# EAGLE design momoinololu (EAGLE 6.3)
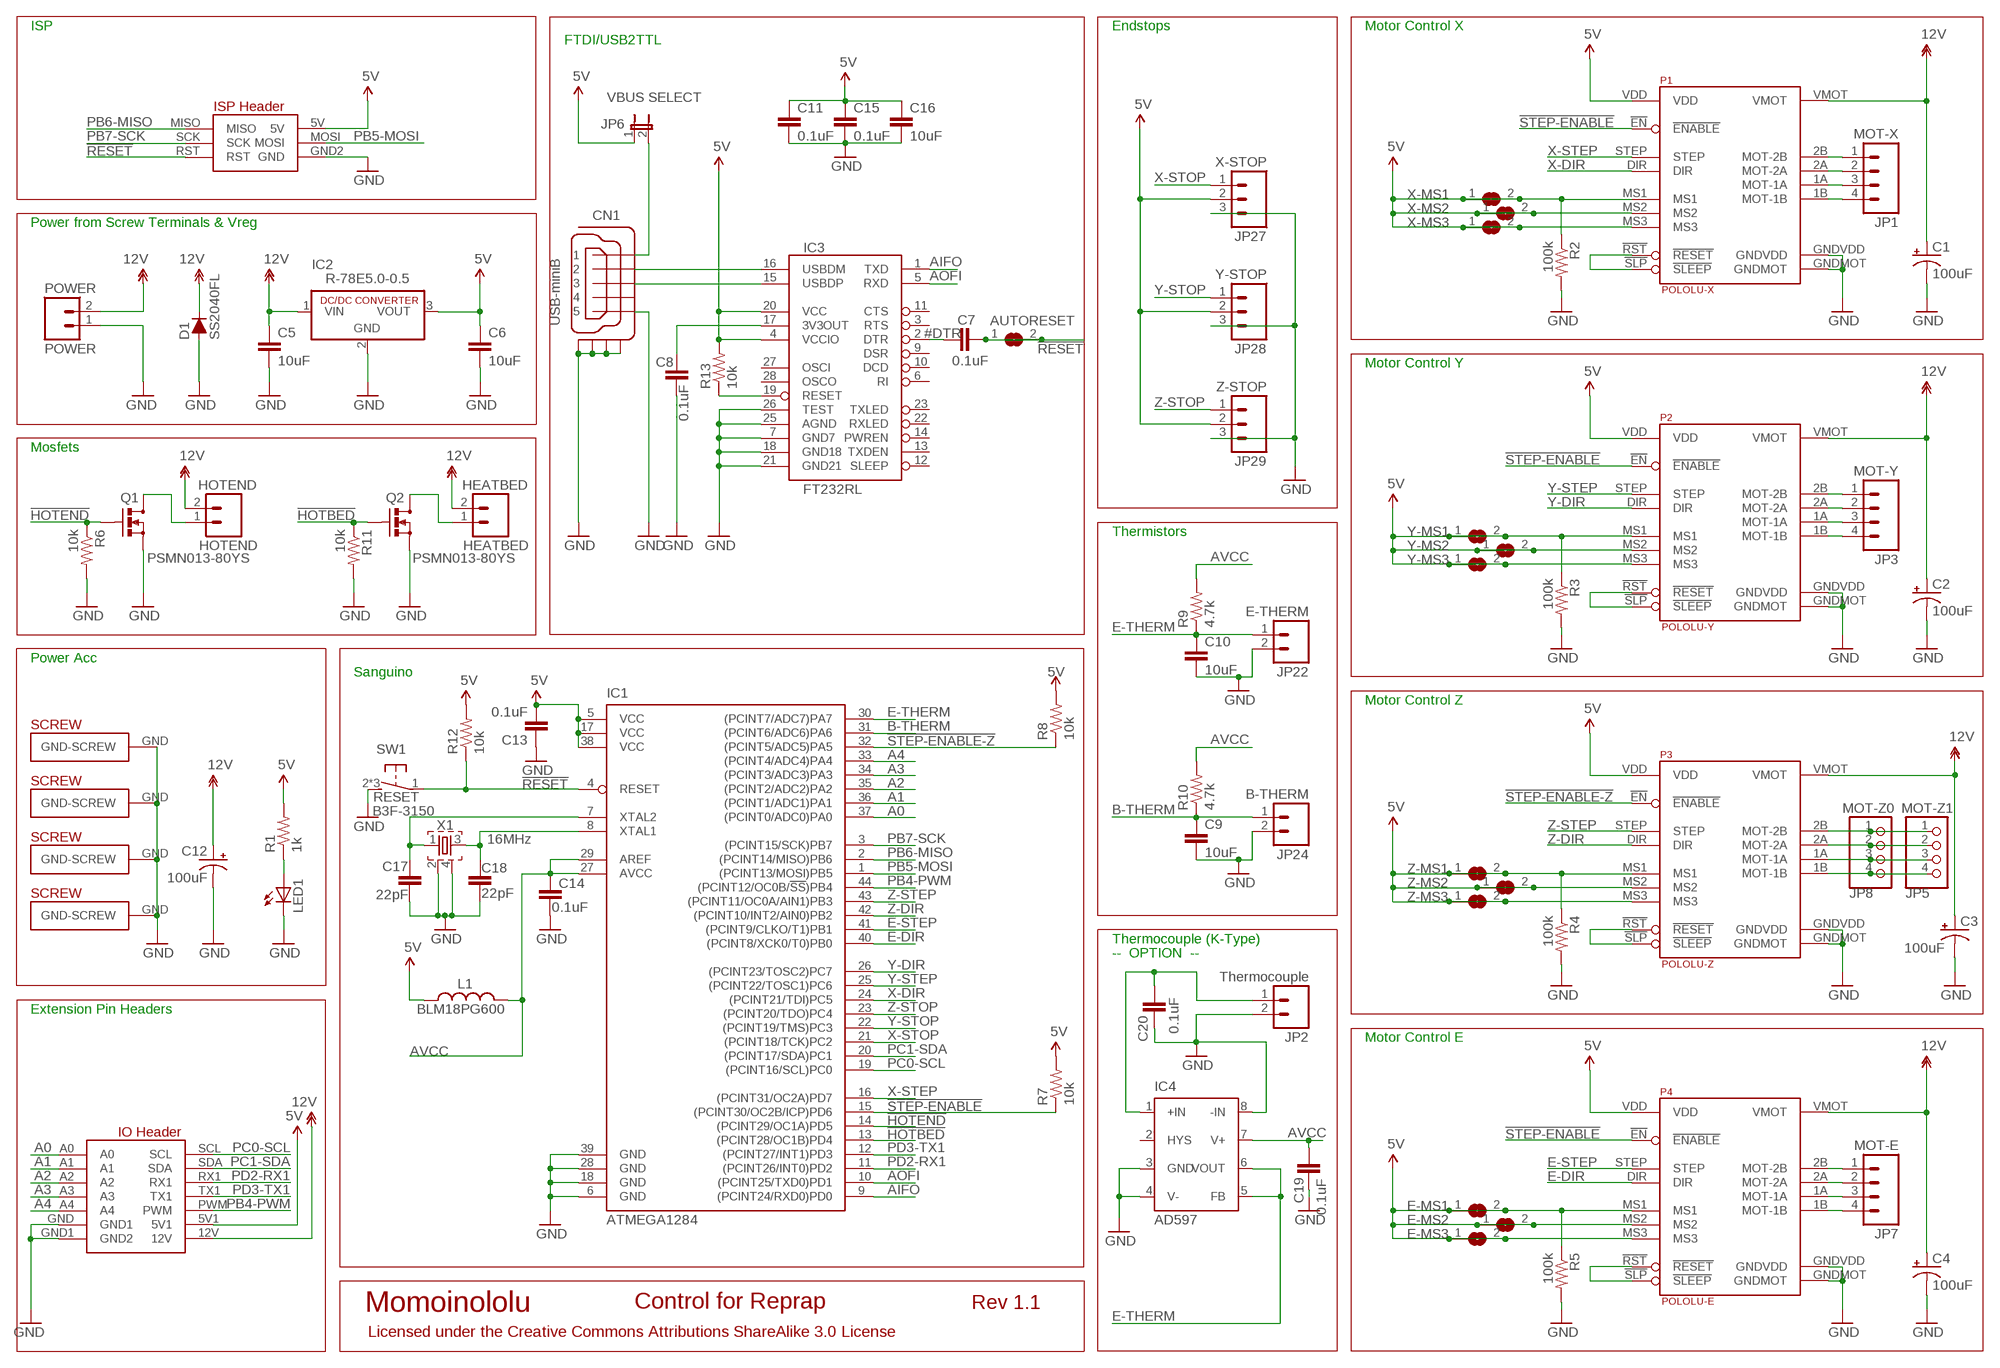
[diagram p0: schematic, sheet 1]

## Parts
AUTORESET  SJ  [SJ]
C1  100uF  CPOL-USUD-6,3X7,7  [UD-6,3X7,7_NICHICON]
C2  100uF  CPOL-USUD-6,3X7,7  [UD-6,3X7,7_NICHICON]
C3  100uF  CPOL-USUD-6,3X7,7  [UD-6,3X7,7_NICHICON]
C4  100uF  CPOL-USUD-6,3X7,7  [UD-6,3X7,7_NICHICON]
C5  10uF  RCL_C-EUC1206K  [RCL_C1206K]
C6  10uF  RCL_C-EUC1206K  [RCL_C1206K]
C7  0.1uF  C-EUC0603  [C0603]
C8  0.1uF  C-EUC0603  [C0603]
C9  10uF  RCL_C-EUC1206K  [RCL_C1206K]
C10  10uF  RCL_C-EUC1206K  [RCL_C1206K]
C11  0.1uF  C-EUC0603  [C0603]
C12  100uF  CPOL-USUD-6,3X7,7  [UD-6,3X7,7_NICHICON]
C13  0.1uF  C-EUC0603  [C0603]
C14  0.1uF  C-EUC0603  [C0603]
C15  0.1uF  C-EUC0603  [C0603]
C16  10uF  RCL_C-EUC1206K  [RCL_C1206K]
C17  22pF  C-EUC0603  [C0603]
C18  22pF  C-EUC0603  [C0603]
C19  0.1uF  C-EUC0603  [C0603]
C20  0.1uF  C-EUC0603  [C0603]
CN1  USB-miniB  CON-HIROSE_MINI-USB-SHIELD-UX60A-MB-5ST  [CON-HIROSE_UX60A-MB-5ST]
D1  SS2040FL  SEMICON-SMD-IPC_D-FILL-SOD123  [SEMICON-SMD-IPC_SOD123]
E-MS1  SJ  [SJ]
E-MS2  SJ  [SJ]
E-MS3  SJ  [SJ]
HEATBED  HEATBED  SPARKFUN_M025.08MM  [SCREWTERMINAL-5.08MM-2]
HOTEND  HOTEND  SPARKFUN_M025.08MM  [SCREWTERMINAL-5.08MM-2]
IC1  ATMEGA1284  ATMEGA644A  [TQFP44]
IC2  R-78E5.0-0.5  R-78C5.0-1.0  [SIP3]
IC3  FT232RL  FT232RLSSOP  [SSOP28DB]
IC4  AD597  [SO8]
JP1  MOT-X  SPARKFUN_M04POLAR  [SPARKFUN_MOLEX-1X4]
JP2  Thermocouple  SPARKFUN_M02PTH  [SPARKFUN_1X02]
JP3  MOT-Y  SPARKFUN_M04POLAR  [SPARKFUN_MOLEX-1X4]
JP5  MOT-Z1  PINHD-1X4  [1X04]
JP6  VBUS SELECT  SPARKFUN_JUMPER-2PTH  [SPARKFUN_1X02]
JP7  MOT-E  SPARKFUN_M04POLAR  [SPARKFUN_MOLEX-1X4]
JP8  MOT-Z0  PINHD-1X4  [1X04]
JP22  E-THERM  SPARKFUN_M02PTH  [SPARKFUN_1X02]
JP24  B-THERM  SPARKFUN_M02PTH  [SPARKFUN_1X02]
JP27  X-STOP  SPARKFUN_M03POLAR  [SPARKFUN_MOLEX-1X3]
JP28  Y-STOP  SPARKFUN_M03POLAR  [SPARKFUN_MOLEX-1X3]
JP29  Z-STOP  SPARKFUN_M03POLAR  [SPARKFUN_MOLEX-1X3]
L1  BLM18PG600  L-USL0603  [L0603]
LED1  LEDSML0805  [SML0805]
P1  POLOLU-X  POLOLU-ALLEGRO_POLOLU-ALLEGRO  [POLOLU-ALLEGRO_POLOLU-ALLEGRO-PTH]
P2  POLOLU-Y  POLOLU-ALLEGRO_POLOLU-ALLEGRO  [POLOLU-ALLEGRO_POLOLU-ALLEGRO-PTH]
P3  POLOLU-Z  POLOLU-ALLEGRO_POLOLU-ALLEGRO  [POLOLU-ALLEGRO_POLOLU-ALLEGRO-PTH]
P4  POLOLU-E  POLOLU-ALLEGRO_POLOLU-ALLEGRO  [POLOLU-ALLEGRO_POLOLU-ALLEGRO-PTH]
POWER  POWER  SPARKFUN_M025.08MM  [SCREWTERMINAL-5.08MM-2]
Q1  PSMN013-80YS  SPARKFUN_MOSFET-NCHANNELSOT669  [SOT669]
Q2  PSMN013-80YS  SPARKFUN_MOSFET-NCHANNELSOT669  [SOT669]
R1  1k  R-US_R0603  [R0603]
R2  100k  R-US_R0603  [R0603]
R3  100k  R-US_R0603  [R0603]
R4  100k  R-US_R0603  [R0603]
R5  100k  R-US_R0603  [R0603]
R6  10k  R-US_R0603  [R0603]
R7  10k  R-US_R0603  [R0603]
R8  10k  R-US_R0603  [R0603]
R9  4.7k  R-US_R0603  [R0603]
R10  4.7k  R-US_R0603  [R0603]
R11  10k  R-US_R0603  [R0603]
R12  10k  R-US_R0603  [R0603]
R13  10k  R-US_R0603  [R0603]
SW1  B3F-3150  31-XX  [B3F-31XX]
U$17  PLATED-SCREW  [PLATEDSCREW]
U$20  PLATED-SCREW  [PLATEDSCREW]
U$24  SANGUINOLOLU_IO_HEADERSNOSCREW  [SANGUINOLOLU_IO_HEADER_NOSCREW]
U$25  PLATED-SCREW  [PLATEDSCREW]
U$31  PLATED-SCREW  [PLATEDSCREW]
X1  16MHz  FA-238  [FA-238]
X-MS1  SJ  [SJ]
X-MS2  SJ  [SJ]
X-MS3  SJ  [SJ]
Y-MS1  SJ  [SJ]
Y-MS2  SJ  [SJ]
Y-MS3  SJ  [SJ]
Z-MS1  SJ  [SJ]
Z-MS2  SJ  [SJ]
Z-MS3  SJ  [SJ]

## Nets
3V3: C8.1 IC3.17(3V3OUT)
5V: C6.1 C11.1 C13.2 C15.1 C16.1 E-MS1.1 E-MS1.2 E-MS2.1 E-MS2.2 E-MS3.1 E-MS3.2 IC1.5(VCC) IC1.17(VCC) IC1.38(VCC) IC2.3(VOUT) IC3.4(VCCIO) IC3.20(VCC) JP6.1 JP27.2 JP28.2 JP29.2 L1.1 P1.MS1 P1.MS2 P1.MS3 P1.VDD P2.MS1 P2.MS2 P2.MS3 P2.VDD P3.MS1 P3.MS2 P3.MS3 P3.VDD P4.MS1 P4.MS2 P4.MS3 P4.VDD R1.2 R2.1 R3.1 R4.1 R5.1 R7.2 R8.2 R12.2 R13.2 U$24.5V U$24.5V1 X-MS1.1 X-MS1.2 X-MS2.1 X-MS2.2 X-MS3.1 X-MS3.2 Y-MS1.1 Y-MS1.2 Y-MS2.1 Y-MS2.2 Y-MS3.1 Y-MS3.2 Z-MS1.1 Z-MS1.2 Z-MS2.1 Z-MS2.2 Z-MS3.1 Z-MS3.2
12V: C1.+ C2.+ C3.+ C4.+ C5.1 C12.+ D1.1(C) HEATBED.2 HOTEND.2 IC2.1(VIN) P1.VMOT P2.VMOT P3.VMOT P4.VMOT POWER.2 U$24.12V
!HOTBED: IC1.13((PCINT28/OC1B)PD4) Q2.4(G) R11.1
!HOTEND: IC1.14((PCINT29/OC1A)PD5) Q1.4(G) R6.1
!RESET: AUTORESET.1 AUTORESET.2 C7.1 IC1.4(RESET) R12.1 SW1.1(P) U$24.RST
!STEP-ENABLE: IC1.15((PCINT30/OC2B/ICP)PD6) P1.!EN(!ENABLE) P2.!EN(!ENABLE) P4.!EN(!ENABLE) R7.1
!STEP-ENABLE-Z: IC1.32((PCINT5/ADC5)PA5) P3.!EN(!ENABLE) R8.1
#DTR: C7.2 IC3.2(DTR)
+IN: C20.1 IC4.1(+IN) JP2.1
A0: IC1.37((PCINT0/ADC0)PA0) U$24.A0
A1: IC1.36((PCINT1/ADC1)PA1) U$24.A1
A2: IC1.35((PCINT2/ADC2)PA2) U$24.A2
A3: IC1.34((PCINT3/ADC3)PA3) U$24.A3
A4: IC1.33((PCINT4/ADC4)PA4) U$24.A4
AIFO: IC1.9((PCINT24/RXD0)PD0) IC3.1(TXD)
AOFI: IC1.10((PCINT25/TXD0)PD1) IC3.5(RXD)
AVCC: C14.1 C19.1 IC1.27(AVCC) IC1.29(AREF) IC4.7(V+) L1.2 R9.2 R10.2
B-THERM: C9.1 IC1.31((PCINT6/ADC6)PA6) JP24.1 R10.1
E-DIR: IC1.40((PCINT8/XCK0/T0)PB0) P4.DIR
E-MOT-1A [power]: JP7.3 P4.1A(MOT-1A)
E-MOT-1B [power]: JP7.4 P4.1B(MOT-1B)
E-MOT-2A [power]: JP7.2 P4.2A(MOT-2A)
E-MOT-2B [power]: JP7.1 P4.2B(MOT-2B)
E-RESETSLEEP: P4.!RST(!RESET) P4.!SLP(!SLEEP)
E-STEP: IC1.41((PCINT9/CLKO/T1)PB1) P4.STEP
E-THERM: C10.1 IC1.30((PCINT7/ADC7)PA7) IC4.5(FB) IC4.6(VOUT) JP22.1 R9.1
GND: C1.- C2.- C3.- C4.- C5.2 C6.2 C8.2 C9.2 C10.2 C11.2 C12.- C13.1 C14.2 C15.2 C16.2 C17.2 C18.2 C19.2 C20.2 CN1.5 CN1.M1(S1) CN1.M2(S2) CN1.M3(S3) CN1.M4(S4) D1.2(A) IC1.6(GND) IC1.18(GND) IC1.28(GND) IC1.39(GND) IC2.2(GND) IC3.7(GND7) IC3.18(GND18) IC3.21(GND21) IC3.25(AGND) IC3.26(TEST) IC4.3(GND) IC4.4(V-) IC4.8(-IN) JP2.2 JP22.2 JP24.2 JP27.3 JP28.3 JP29.3 LED1.C P1.GNDMOT P1.GNDVDD P2.GNDMOT P2.GNDVDD P3.GNDMOT P3.GNDVDD P4.GNDMOT P4.GNDVDD POWER.1 Q1.1(S) Q1.2(S) Q1.3(S) Q2.1(S) Q2.2(S) Q2.3(S) R2.2 R3.2 R4.2 R5.2 R6.2 R11.2 SW1.2(S) SW1.3(S) SW1.4(S) U$17.GND(GND-SCREW) U$20.GND(GND-SCREW) U$24.GND1(GND2) U$24.GND2(GND) U$24.GND(GND1) U$25.GND(GND-SCREW) U$31.GND(GND-SCREW) X1.2 X1.4
HEATBED-GND [power]: HEATBED.1 Q2.MB(D)
HOTEND-GND: HOTEND.1 Q1.MB(D)
LED1: LED1.A R1.1
N$1: C17.1 IC1.7(XTAL2) X1.1
N$2: IC3.19(RESET) R13.1
N$3: C18.1 IC1.8(XTAL1) X1.3
N$6: CN1.2 IC3.16(USBDM)
N$7: CN1.3 IC3.15(USBDP)
PB4-PWM: IC1.44((PCINT12/OC0B/!SS!)PB4) U$24.PWM
PB5-MOSI: IC1.1((PCINT13/MOSI)PB5) U$24.MOSI
PB6-MISO: IC1.2((PCINT14/MISO)PB6) U$24.MISO
PB7-SCK: IC1.3((PCINT15/SCK)PB7) U$24.SCK
PC0-SCL: IC1.19((PCINT16/SCL)PC0) U$24.SCL
PC1-SDA: IC1.20((PCINT17/SDA)PC1) U$24.SDA
PD2-RX1: IC1.11((PCINT26/INT0)PD2) U$24.RX1
PD3-TX1: IC1.12((PCINT27/INT1)PD3) U$24.TX1
VBUS: CN1.1 JP6.2
X-DIR: IC1.24((PCINT21/TDI)PC5) P1.DIR
X-MOT-1A [power]: JP1.3 P1.1A(MOT-1A)
X-MOT-1B [power]: JP1.4 P1.1B(MOT-1B)
X-MOT-2A [power]: JP1.2 P1.2A(MOT-2A)
X-MOT-2B [power]: JP1.1 P1.2B(MOT-2B)
X-RESETSLEEP: P1.!RST(!RESET) P1.!SLP(!SLEEP)
X-STEP: IC1.16((PCINT31/OC2A)PD7) P1.STEP
X-STOP: IC1.21((PCINT18/TCK)PC2) JP27.1
Y-DIR: IC1.26((PCINT23/TOSC2)PC7) P2.DIR
Y-MOT-1A [power]: JP3.3 P2.1A(MOT-1A)
Y-MOT-1B [power]: JP3.4 P2.1B(MOT-1B)
Y-MOT-2A [power]: JP3.2 P2.2A(MOT-2A)
Y-MOT-2B [power]: JP3.1 P2.2B(MOT-2B)
Y-RESETSLEEP: P2.!RST(!RESET) P2.!SLP(!SLEEP)
Y-STEP: IC1.25((PCINT22/TOSC1)PC6) P2.STEP
Y-STOP: IC1.22((PCINT19/TMS)PC3) JP28.1
Z-DIR: IC1.42((PCINT10/INT2/AIN0)PB2) P3.DIR
Z-MOT-1A [power]: JP5.3 JP8.3 P3.1A(MOT-1A)
Z-MOT-1B [power]: JP5.4 JP8.4 P3.1B(MOT-1B)
Z-MOT-2A [power]: JP5.2 JP8.2 P3.2A(MOT-2A)
Z-MOT-2B [power]: JP5.1 JP8.1 P3.2B(MOT-2B)
Z-RESETSLEEP: P3.!RST(!RESET) P3.!SLP(!SLEEP)
Z-STEP: IC1.43((PCINT11/OC0A/AIN1)PB3) P3.STEP
Z-STOP: IC1.23((PCINT20/TDO)PC4) JP29.1
Unconnected: CN1.4 IC3.3(RTS) IC3.6(RI) IC3.9(DSR) IC3.10(DCD) IC3.11(CTS) IC3.12(SLEEP) IC3.13(TXDEN) IC3.14(PWREN) IC3.22(RXLED) IC3.23(TXLED) IC3.27(OSCI) IC3.28(OSCO) IC4.2(HYS)

## Notes on the sheet
- ISP | Endstops | Motor Control X
- FTDI/USB2TTL
- Power from Screw Terminals & Vreg
- Motor Control Y
- Mosfets
- Thermistors
- Power Acc
- Sanguino
- Motor Control Z
- RESET
- Thermocouple (K-Type)
- --  OPTION  --
- Extension Pin Headers
- Motor Control E
- Momoinololu | Control for Reprap | Rev 1.1
- Licensed under the Creative Commons Attributions ShareAlike 3.0 License

## Library data of the parts
AUTORESET E-MS1-E-MS3 X-MS1-X-MS3 Y-MS1-Y-MS3 Z-MS1-Z-MS3 = Sanguinololu:SJ: SMD solder JUMPER
C1-C4 C12 = rcl:CPOL-US: POLARIZED CAPACITOR, American symbol
C5 C6 C9 C10 C16 = Sanguinololu:RCL_C-EU: CAPACITOR, European symbol
C7 C8 C11 C13-C15 C17-C20 = rcl:C-EU: CAPACITOR, European symbol
CN1 = Sanguinololu:CON-HIROSE_MINI-USB-SHIELD-: MINI USB Connector Source: http://www.hirose.co.jp/cataloge_hp/e24000019.pdf; OC_FARNELL: unknown; OC_NEWARK: unknown
D1 = Sanguinololu:SEMICON-SMD-IPC_D-FILL-: DIODE filled
HEATBED HOTEND JP2 JP22 JP24 POWER = Sanguinololu:SPARKFUN_M02: Header 2 Standard 2-pin 0.1" header. Use with straight break away headers (SKU : PRT-00116), right angle break away headers (PRT-00553), swiss pins (PRT-00743), machine pins (PRT-00117), and female headers (PRT-00115). Molex polarized connector foot print use with SKU : PRT-08233 with associated crimp pins and housings.
IC1 = atmel:ATMEGA644: 8-bit Microcontroller with 64K Bytes In-System Programmable Flash Source: http://www.atmel.com/dyn/resources/prod_documents/doc2593.pdf; MPN: ATMEGA644PV-10AU; OC_FARNELL: 1455123; OC_NEWARK: 58M3748
IC2 = Sanguinololu:R-78C*-1.0: INNOLINE DC/DC-Converter 1.0 AMP SIP3 Single Output Source: Data sheet <http://www.mikrocontroller.net/attachment/150645/157764-da-01-en-DC_DC_WANDLER_R_78C5_0_1_0.pdf>
IC3 = SparkFun:FT232RL: USB UART FT232RL 4th Generation USB UART (USB <-> Serial) Controller. Spark Fun Electronics SKU : COM-00650
IC4 = Sanguinololu:AD597: http://www.analog.com/static/imported-files/data_sheets/AD596_597.pdf
JP1 JP3 JP7 = Sanguinololu:SPARKFUN_M04: Header 4 Standard 4-pin 0.1" header. Use with straight break away headers (SKU : PRT-00116), right angle break away headers (PRT-00553), swiss pins (PRT-00743), machine pins (PRT-00117), and female headers (PRT-00115). Molex polarized connector foot print use with SKU : PRT-08231 with associated crimp pins and housings.
JP5 JP8 = Sanguinololu:PINHD-1X4: PIN HEADER
JP6 = Sanguinololu:SPARKFUN_JUMPER-2: Jumper Basic 0.1" spaced jumper. Use with breakaway headers.
JP27-JP29 = Sanguinololu:SPARKFUN_M03: Header 3 Standard 3-pin 0.1" header. Use with straight break away headers (SKU : PRT-00116), right angle break away headers (PRT-00553), swiss pins (PRT-00743), machine pins (PRT-00117), and female headers (PRT-00115). Molex polarized connector foot print use with SKU : PRT-08232 with associated crimp pins and housings.
L1 = rcl:L-US: INDUCTOR, American symbol
LED1 = led:LED: LED OSRAM: - CHIPLED LG R971, LG N971, LY N971, LG Q971, LY Q971, LO R971, LY R971 LH N974, LH R974 LS Q976, LO Q976, LY Q976 LO Q996 - Hyper CHIPLED LW Q18S LB Q993, LB Q99A, LB R99A - SideLED LS A670, LO A670, LY A670, LG A670, LP A670 LB A673, LV A673, LT A673, LW A673 LH A674 LY A675 LS A676, LA A676, LO A676, LY A676, LW A676 LS A679, LY A679, LG A679 - Hyper Micro SIDELED® LS Y876, LA Y876, LO Y876, LY Y876 LT Y87S - SmartLED LW L88C, LW L88S LB L89C, LB L89S, LG L890 LS L89K, LO L89K, LY L89K LS L896, LA L896, LO L896, LY L896 - TOPLED LS T670, LO T670, LY T670, LG T670, LP T670 LSG T670, LSP T670, LSY T670, LOP T670, LYG T670 LG T671, LOG T671, LSG T671 LB T673, LV T673, LT T673, LW T673 LH T674 LS T676, LA T676, LO T676, LY T676, LB T676, LH T676, LSB T676, LW T676 LB T67C, LV T67C, LT T67C, LS T67K, LO T67K, LY T67K, LW E67C LS E67B, LA E67B, LO E67B, LY E67B, LB E67C, LV E67C, LT E67C LW T67C LS T679, LY T679, LG T679 LS T770, LO T770, LY T770, LG T770, LP T770 LB T773, LV T773, LT T773, LW T773 LH T774 LS E675, LA E675, LY E675, LS T675 LS T776, LA T776, LO T776, LY T776, LB T776 LHGB T686 LT T68C, LB T68C - Hyper Mini TOPLED® LB M676 - Mini TOPLED Santana® LG M470 LS M47K, LO M47K, LY M47K Source: http://www.osram.convergy.de LUXEON: - LUMILED® LXK2-PW12-R00, LXK2-PW12-S00, LXK2-PW14-U00, LXK2-PW14-V00 LXK2-PM12-R00, LXK2-PM12-S00, LXK2-PM14-U00 LXK2-PE12-Q00, LXK2-PE12-R00, LXK2-PE12-S00, LXK2-PE14-T00, LXK2-PE14-U00 LXK2-PB12-K00, LXK2-PB12-L00, LXK2-PB12-M00, LXK2-PB14-N00, LXK2-PB14-P00, LXK2-PB14-Q00 LXK2-PR12-L00, LXK2-PR12-M00, LXK2-PR14-Q00, LXK2-PR14-R00 LXK2-PD12-Q00, LXK2-PD12-R00, LXK2-PD12-S00 LXK2-PH12-R00, LXK2-PH12-S00 LXK2-PL12-P00, LXK2-PL12-Q00, LXK2-PL12-R00 Source: www.luxeon.com KINGBRIGHT: KA-3528ASYC Source: www.kingbright.com
P1-P4 = Sanguinololu:POLOLU-ALLEGRO_POLOLU-ALLEGRO
Q1 Q2 = Sanguinololu:SPARKFUN_MOSFET-NCHANNEL
R1-R13 = rcl:R-US_: RESISTOR, American symbol
SW1 = Sanguinololu:31-XX: OMRON SWITCH; MPN: B3F-3100; OC_FARNELL: 959704; OC_NEWARK: 36M3582
U$17 U$20 U$25 U$31 = Sanguinololu:PLATED-SCREW
U$24 = Sanguinololu:SANGUINOLOLU_IO_HEADERS
X1 = Sanguinololu:FA-: MHz RANGE CRYSTAL UNIT Source: Epson Toyocom

## Board
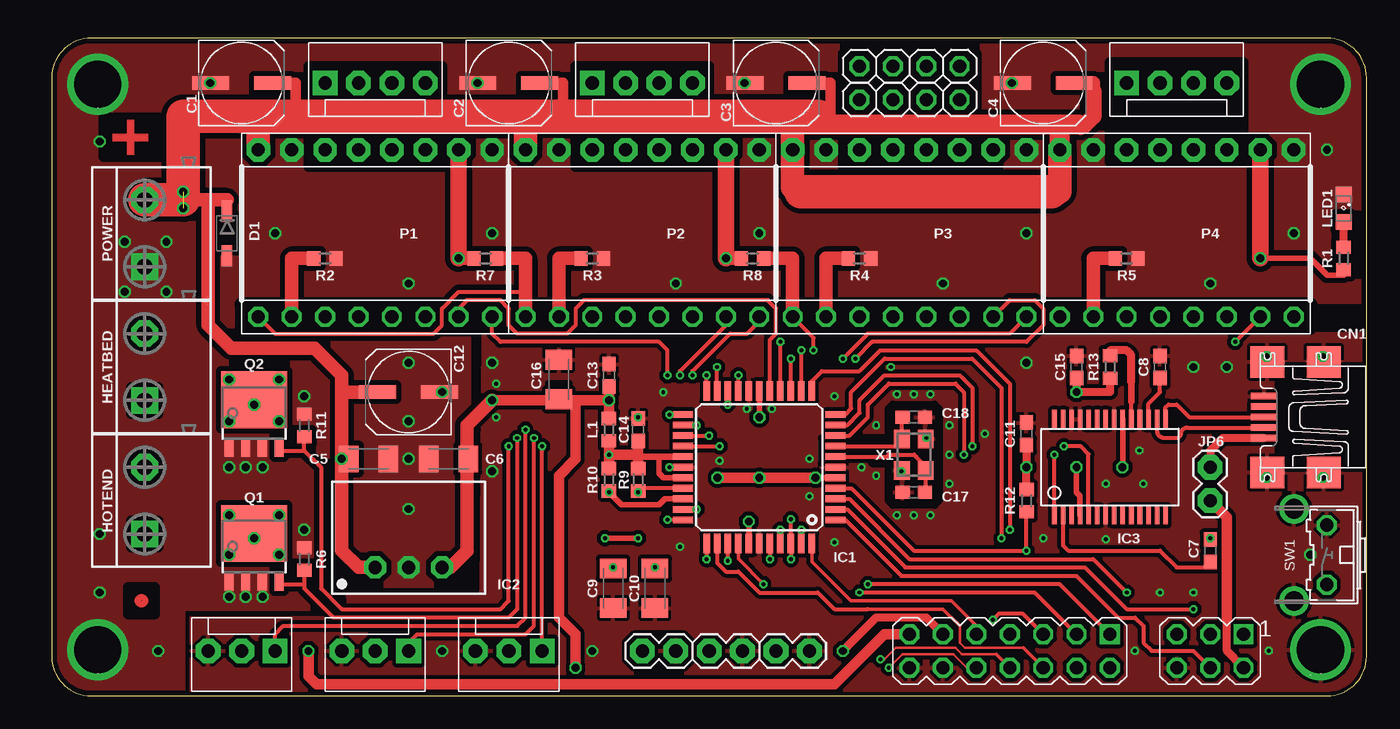
[diagram p1: board, top side]
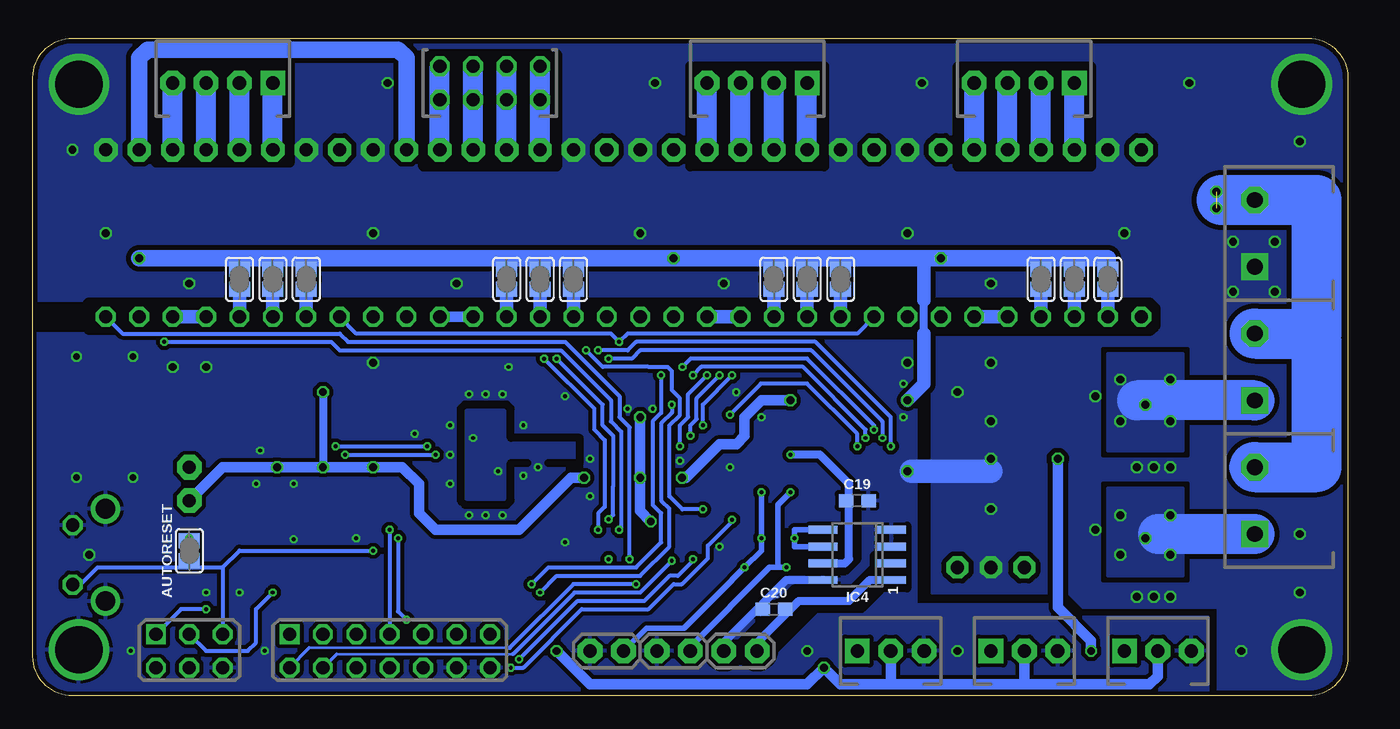
[diagram p2: board, bottom side, seen from below]

Size 100 x 50 mm. Coordinates in mm from the lower left corner, seen from the top.
Outline: 97,0 arc90 100,3
Outline: 100,47 arc90 97,50
Outline: 3,50 arc90 0,47
Outline: 0,3 arc90 3,0
Outline: 3,0 97,0
Outline: 97,0 arc90 100,3
Outline: 100,3 100,47
Outline: 100,47 arc90 97,50
Outline: 97,50 3,50
Outline: 3,50 arc90 0,47
Outline: 0,47 0,3
Outline: 0,3 arc90 3,0
Copper layers (1*16): Top 0.035mm / dielectric 1.5mm / Bottom 0.035mm
Design rules "Elecrow_2-layer_eagle_rule *": minimum track width 6mil, minimum drill 0.3mm, track to track 6mil, track to pad 6mil, pad to pad 6mil, via to via 6mil, smd to smd 0mil, copper to edge 10mil, drill to drill 10mil, minimum pad ring 10mil, minimum via ring 6mil, stop-mask expansion 2mil, vias tented up to drill 100mil, thermal gap 10mil
tKeepout: 8 lines
tRestrict: area 19.5,40.2 to 29.7,47.9; area 39.8,40.2 to 50,47.9; area 80.5,40.6 to 90.6,48.2; area 60.2,40.2 to 70.3,48.8; area 12.6,33.9 to 14.1,36.4; area 5.8,6.2 to 7.8,8.2; 26 lines
bRestrict: area 60.1,40.2 to 70.3,48.8; area 80.5,40.5 to 90.6,48.2; area 19.5,40.2 to 29.7,47.9; area 39.8,40.3 to 50,47.9; 38 lines

### Footprints (pad centres in the part's own frame; a part is rotated, then mirrored left to right if it is on the bottom)
SJ = smd 1.168 x 1.6: 1 -0.762,0; 2 0.762,0
UD-6,3X7,7_NICHICON = smd 2.8 x 1: + 2.35,0; - -2.35,0
RCL_C1206K = smd 1.5 x 2: 1 -1.5,0; 2 1.5,0
C0603 = smd 1.1 x 1: 1 -0.85,0; 2 0.85,0
CON-HIROSE_UX60A-MB-5ST = smd 2 x 0.5: 1 2.25,1.6; 2 2.25,0.8; 3 2.25,0; 4 2.25,-0.8; 5 2.25,-1.6 | smd 2.6 x 2.4: M1 -2.3,-4.2; M2 -2.3,4.2; M3 2,4.2; M4 2,-4.2
SEMICON-SMD-IPC_SOD123 = smd 1.6 x 0.8: 1 -1.7,0; 2 1.7,0
SCREWTERMINAL-5.08MM-2 = drill 1.2 pad 2.032 square: 1 -2.54,0 | drill 1.2 pad 2.032 octagon: 2 2.54,0
TQFP44 = smd 1.5 x 0.5: 1 -5.8,4; 2 -5.8,3.2; 3 -5.8,2.4; 4 -5.8,1.6; 5 -5.8,0.8; 6 -5.8,0; 7 -5.8,-0.8; 8 -5.8,-1.6; 9 -5.8,-2.4; 10 -5.8,-3.2; 11 -5.8,-4; 23 5.8,-4; 24 5.8,-3.2; 25 5.8,-2.4; 26 5.8,-1.6; 27 5.8,-0.8; 28 5.8,0; 29 5.8,0.8; 30 5.8,1.6; 31 5.8,2.4; 32 5.8,3.2; 33 5.8,4 | smd 0.5 x 1.5: 12 -4,-5.8; 13 -3.2,-5.8; 14 -2.4,-5.8; 15 -1.6,-5.8; 16 -0.8,-5.8; 17 0,-5.8; 18 0.8,-5.8; 19 1.6,-5.8; 20 2.4,-5.8; 21 3.2,-5.8; 22 4,-5.8; 34 4,5.8; 35 3.2,5.8; 36 2.4,5.8; 37 1.6,5.8; 38 0.8,5.8; 39 0,5.8; 40 -0.8,5.8; 41 -1.6,5.8; 42 -2.4,5.8; 43 -3.2,5.8; 44 -4,5.8
SIP3 = drill 1 pad 1.676 octagon: 1 -2.54,0; 2 0,0; 3 2.54,0
SSOP28DB = smd 0.348 x 1.397: 1 -4.225,-3.656; 2 -3.575,-3.656; 3 -2.925,-3.656; 4 -2.275,-3.656; 5 -1.625,-3.656; 6 -0.975,-3.656; 7 -0.325,-3.656; 8 0.325,-3.656; 9 0.975,-3.656; 10 1.625,-3.656; 11 2.275,-3.656; 12 2.925,-3.656; 13 3.575,-3.656; 14 4.225,-3.656; 15 4.225,3.656; 16 3.575,3.656; 17 2.925,3.656; 18 2.275,3.656; 19 1.625,3.656; 20 0.975,3.656; 21 0.325,3.656; 22 -0.325,3.656; 23 -0.975,3.656; 24 -1.625,3.656; 25 -2.275,3.656; 26 -2.925,3.656; 27 -3.575,3.656; 28 -4.225,3.656
SO8 = smd 0.6 x 2.2: 1 -1.905,-2.6; 2 -0.635,-2.6; 3 0.635,-2.6; 4 1.905,-2.6; 5 1.905,2.6; 6 0.635,2.6; 7 -0.635,2.6; 8 -1.905,2.6
SPARKFUN_MOLEX-1X4 = drill 1 pad 1.88 square: 1 0,0 | drill 1 pad 1.88 octagon: 2 2.54,0; 3 5.08,0; 4 7.62,0
SPARKFUN_1X02 = drill 1 pad 1.88 octagon: 1 0,0; 2 2.54,0
1X04 = drill 1 octagon: 1 -3.81,0; 2 -1.27,0; 3 1.27,0; 4 3.81,0
SPARKFUN_MOLEX-1X3 = drill 1 pad 1.88 square: 1 0,0 | drill 1 pad 1.88 octagon: 2 2.54,0; 3 5.08,0
L0603 = smd 1 x 1.1: 1 -0.85,0; 2 0.85,0
SML0805 = smd 1.2 x 1.2: A 1.05,0; C -1.05,0
POLOLU-ALLEGRO_POLOLU-ALLEGRO-PTH = drill 1 pad 1.778 octagon: 1A 6.35,-1.27; 1B 6.35,-3.81; 2A 6.35,1.27; 2B 6.35,3.81; GNDMOT 6.35,6.35; GNDVDD 6.35,-8.89; VDD 6.35,-6.35; VMOT 6.35,8.89 | drill 1 octagon: !EN -6.35,8.89; !RST -6.35,-1.27; !SLP -6.35,-3.81; DIR -6.35,-8.89; MS1 -6.35,6.35; MS2 -6.35,3.81; MS3 -6.35,1.27; STEP -6.35,-6.35
SOT669 = smd 0.7 x 1.4: 1 -1.905,-2.65; 2 -0.635,-2.65; 3 0.635,-2.65; 4 1.905,-2.65 | smd 5 x 4.3: MB 0,1
R0603 = smd 1 x 1.1: 1 -0.85,0; 2 0.85,0
B3F-31XX = drill 1.016 octagon: 1 -2.261,-1.245; 2 2.261,-1.245 | drill 1.499 pad 2.159: 3 -3.505,1.245; 4 3.505,1.245
PLATEDSCREW = drill 3.6: GND 0,0
SANGUINOLOLU_IO_HEADER_NOSCREW = drill 1 octagon: 5V -5.08,-1.27; 5V1 -27.94,1.27; 12V -30.48,1.27; A0 -15.24,-1.27; A1 -17.78,-1.27; A2 -20.32,-1.27; A3 -22.86,-1.27; A4 -25.4,-1.27; GND -10.16,-1.27; GND1 -27.94,-1.27; GND2 -30.48,-1.27; MOSI -7.62,-1.27; PWM -25.4,1.27; RST -10.16,1.27; RX1 -20.32,1.27; SCK -7.62,1.27; SDA -17.78,1.27; TX1 -22.86,1.27 | drill 1 square: MISO -5.08,1.27; SCL -15.24,1.27
FA-238 = smd 1.4 x 1.2: 1 -1.2,-0.9; 2 1.2,-0.9; 3 1.2,0.9; 4 -1.2,0.9

### Placement (x,y rotation side)
AUTORESET  88.1,11.03 270 bottom
C1  14.44,46.59 0 top
C2  34.76,46.59 0 top
C3  55.08,46.59 0 top
C4  75.4,46.59 0 top
C5  24.09,18.02 0 top
C6  30.19,18.02 180 top
C7  88.1,11.03 270 top
C8  84.29,25 90 top
C9  42.7,8.17 270 top
C10  45.87,8.17 270 top
C11  74.13,19.92 90 top
C12  27.14,23.09 180 top
C13  42.38,24.36 270 top
C14  44.6,20.24 90 top
C15  77.94,25 90 top
C16  38.57,24.05 90 top
C17  65.56,15.47 180 top
C18  65.56,21.19 0 top
C19  37.3,14.84 0 bottom
C20  43.65,6.59 180 bottom
CN1  94.45,21.19 180 top
D1  13.33,35.16 270 top
E-MS1  79.21,31.67 270 bottom
E-MS2  81.75,31.67 270 bottom
E-MS3  84.29,31.67 270 bottom
HEATBED  7.07,25 90 top
HOTEND  7.07,14.84 90 top
IC1  53.81,17.38 180 top
IC2  27.14,9.76 0 top
IC3  80.48,17.38 0 top
IC4  37.3,10.71 90 bottom
JP1  20.79,46.59 0 top
JP2  44.92,3.41 0 top
JP3  41.11,46.59 0 top
JP5  65.24,47.86 0 top
JP6  88.1,14.84 90 top
JP7  81.75,46.59 0 top
JP8  65.24,45.32 0 top
JP22  55.08,3.41 0 top
JP24  50,3.41 0 top
JP27  16.98,3.41 180 top
JP28  27.14,3.41 180 top
JP29  37.3,3.41 180 top
L1  42.38,20.24 270 top
LED1  98.26,37.06 270 top
P1  24.6,35.16 90 top
P2  44.92,35.16 90 top
P3  65.24,35.16 90 top
P4  85.56,35.16 90 top
POWER  7.07,35.16 90 top
Q1  15.39,11.35 0 top
Q2  15.39,21.51 0 top
R1  98.26,33.26 270 top
R2  20.79,33.26 0 top
R3  41.11,33.26 0 top
R4  61.43,33.26 0 top
R5  81.75,33.26 0 top
R6  19.2,10.39 90 top
R7  32.98,33.26 180 top
R8  53.3,33.26 180 top
R9  44.6,16.43 90 top
R10  42.38,16.43 90 top
R11  19.2,20.55 90 top
R12  74.13,14.84 90 top
R13  80.48,25 270 top
SW1  95.72,10.71 90 top
U$17  96.5,46.5 0 top
U$20  96.5,3.5 0 top
U$24  95.72,3.41 0 top
U$25  3.5,3.5 0 top
U$31  3.5,46.5 0 top
X1  65.56,18.33 90 top
X-MS1  18.25,31.67 270 bottom
X-MS2  20.79,31.67 270 bottom
X-MS3  23.33,31.67 270 bottom
Y-MS1  38.57,31.67 270 bottom
Y-MS2  41.11,31.67 270 bottom
Y-MS3  43.65,31.67 270 bottom
Z-MS1  58.89,31.67 270 bottom
Z-MS2  61.43,31.67 270 bottom
Z-MS3  63.97,31.67 270 bottom

### Tracks (layer width: path | path; a pad name or v marks a point on that pad's centre or on a via)
3V3
  Top 0.305: IC3.17 83.41,22.21 84.29,23.09 C8.1
5V  (via drill 0.6)
  Top 0.406: IC1.38 v53.01,13.25 | IC1.17 v53.81,21.19 | R1.2 98.26,31.98 96.99,31.98 95.72,33.26 v91.91,33.26 | IC3.4 78.2,15.21 77.94,15.47 v77.94,17.38 | IC3.20 81.45,17.4 v81.43,17.38 | IC1.5 v58.1,16.58
  Top 0.61: U$24.5V 89.37,3.41 89.37,5.95 | U$24.5V1 66.51,5.95 62.7,5.95 v60.16,3.41 | R12.2 v74.13,17.38 C11.1 | C15.1 v77.94,23.09 80.48,23.09 R13.2
  Top 0.813: 38.57,22.46 v33.49,22.46 | C16.1 38.57,22.46 | 38.57,22.46 39.84,22.46 | 39.84,22.46 v42.38,22.46 | C13.2 v42.38,22.46 | v50.64,16.58 v53.81,16.58 v58.1,16.58 | L1.1 v42.38,22.46 | 89.37,5.95 89.37,13.57 JP6.1 | v39.84,2.14 39.84,4.68 38.57,5.95 38.57,16.74 39.84,18.02 39.84,22.46 | C6.1 31.69,17.79 31.59,17.38
  Top 1.016: v33.49,22.46 31.59,20.55 31.59,17.38 31.59,11.03 30.32,9.76 IC2.3 | R7.2 v30.95,33.26 | R8.2 v51.27,33.26 | R2.1 18.25,33.26 P1.MS1 | R4.1 58.89,33.26 P3.MS1 | R5.1 79.21,33.26 P4.MS1 | R3.1 38.57,33.26 P2.MS1
  Top 1.27: P1.VDD v30.95,33.26 | P4.VDD v91.91,33.26 | P2.VDD v51.27,33.26
  Bottom 0.406: X-MS1.1 X-MS1.2 | X-MS2.1 X-MS2.2 | X-MS3.1 X-MS3.2 | Y-MS1.1 Y-MS1.2 | Y-MS2.1 Y-MS2.2 | Y-MS3.1 Y-MS3.2 | Z-MS2.1 Z-MS2.2 | Z-MS3.1 Z-MS3.2 | Z-MS1.2 Z-MS1.1 | E-MS2.1 E-MS2.2 | E-MS3.1 E-MS3.2 | E-MS1.1 E-MS1.2
  Bottom 0.61: E-MS3.1 84.29,33.26 | E-MS1.1 79.21,33.26 | Z-MS3.1 63.97,33.26 | Z-MS2.1 61.43,33.26 | Z-MS1.1 58.89,33.26 | Y-MS3.1 43.65,33.26 | Y-MS2.1 41.11,33.26 | Y-MS1.1 38.57,33.26 | 32.22,27.54 32.22,30.08 | X-MS2.1 20.79,33.26 | X-MS3.1 23.33,33.26 | E-MS2.1 81.75,33.26 | 58.89,30.4 Z-MS1.2 | v77.94,23.09 v77.94,17.38
  Bottom 0.813: v42.38,22.46 44.6,22.46 45.87,21.19 45.87,19.76 46.51,19.13 47.78,19.13 50.32,16.58 v50.64,16.58 | JP27.2 14.44,1.5 15.08,0.87 24.6,0.87 | 24.6,0.87 34.76,0.87 | 34.76,0.87 38.57,0.87 v39.84,2.14 41.11,0.87 57.62,0.87 v60.16,3.41 | JP28.2 24.6,0.87 | JP29.2 34.76,0.87 | JP6.1 85.56,17.38 v81.43,17.38 v77.94,17.38 v74.13,17.38 71.91,17.38 70.64,16.11 70.64,13.89 69.37,12.62 63.02,12.62 59.05,16.58 v58.1,16.58 | v53.81,21.19 v53.81,16.58 53.81,14.05 v53.01,13.25
  Bottom 1.016: 32.22,27.54 32.22,23.73 v33.49,22.46 | 32.22,30.08 32.22,33.26 | P4.MS2 E-MS2.2 | P4.MS3 E-MS3.2 | Z-MS1.2 P3.MS1 | P3.MS2 Z-MS2.2 | P3.MS3 Z-MS3.2 | Y-MS1.2 P2.MS1 | P2.MS2 Y-MS2.2 | P2.MS3 Y-MS3.2 | X-MS1.2 P1.MS1 | P1.MS2 X-MS2.2 | P1.MS3 X-MS3.2 | P4.MS1 E-MS1.2
  Bottom 1.27: X-MS1.1 18.25,33.26 20.79,33.26 23.33,33.26 v30.95,33.26 32.22,33.26 38.57,33.26 41.11,33.26 43.65,33.26 v51.27,33.26 58.89,33.26 61.43,33.26 63.97,33.26 79.21,33.26 81.75,33.26 84.29,33.26 v91.91,33.26 | P3.VDD 71.59,48.5 72.22,49.13 91.28,49.13 91.91,48.5 P4.VDD
12V  (via drill 0.6)  (2 unrouted)
  Top 0.61: C5.1 v22.06,18.02
  Top 0.813: U$24.12V 63.34,4.68 59.52,0.87 20.16,0.87 19.52,1.5 v19.52,3.41 | C1.+ 18.57,46.59 18.57,44.05 | C2.+ 38.89,46.59 38.89,44.05 | C3.+ 59.21,46.59 59.21,44.05 58.26,44.05 | D1.1 13.33,37.7 | 11.9,37.7 12.06,37.7
  Top 1.016: 22.06,23.09 22.06,24.36 20,26.43 13.65,26.43 11.9,28.18 11.9,37.7 9.99,37.7 | 22.06,23.09 v22.06,18.02 22.06,11.03 23.33,9.76 IC2.1 | C12.+ 22.06,23.09 | C4.+ 79.21,46.59 79.21,45.95 | 13.33,37.7 12.06,37.7
  Top 1.27: 76.67,38.34 76.03,38.34 | 56.35,38.65 56.67,38.34 56.98,38.34 | 56.35,43.41 56.35,44.05 | 79.21,45.95 79.21,44.05 78.58,43.41 78.26,43.41
  Top 1.524: 78.26,43.41 76.67,43.41 | P4.VMOT 76.67,43.41 | 76.67,43.41 56.35,43.41
  Top 1.778: P1.VMOT 15.71,44.05 | 36.03,44.05 P2.VMOT | P4.VMOT 76.67,38.34 | 56.35,38.65 P3.VMOT 56.35,43.41
  Top 2.54: 58.26,44.05 56.35,44.05 38.89,44.05 36.03,44.05 18.57,44.05 15.71,44.05 9.99,44.05 9.99,37.7 POWER.2 | 76.03,38.34 56.98,38.34
  Bottom 0.813: v19.52,3.41 19.52,4.2 22.06,6.74 v22.06,18.02
  Bottom 2.54: HOTEND.2 7.77,17.38 | 2.38,26.91 2.38,27.54
  Bottom 3.81: HEATBED.2 2.38,27.54 2.38,37.7 POWER.2 9.61,37.7 | HOTEND.2 2.38,17.38 2.38,26.91
  other vias: 9.99,38.34 9.99,37.06
!HOTBED  (via drill 0.3)
  Top 0.305: IC1.13 v57.01,26.27 | v34.76,18.97 34.76,7.22 34.12,6.59 22.06,6.59 20.47,8.17 20.47,17.38 19.2,18.65 | 19.2,18.65 R11.1 | Q2.4 17.3,18.65 19.2,18.65
  Bottom 0.305: v34.76,18.97 34.76,21.19 40.48,26.91 54.13,26.91 54.76,26.27 v57.01,26.27
!HOTEND  (via drill 0.3)
  Top 0.254: Q1.4 17.51,8.49
  Top 0.305: IC1.14 v56.21,25.64 | v35.39,19.6 35.39,6.59 34.76,5.95 21.43,5.95 19.2,8.17 19.2,8.49 | R6.1 19.2,8.49 | 17.51,8.49 19.2,8.49
  Bottom 0.305: v56.21,25.64 54.45,25.64 53.81,26.27 40.79,26.27 35.39,20.87 v35.39,19.6
!RESET  (via drill 0.3)
  Top 0.305: R12.1 v74.13,11.03 65.56,11.03 60.81,15.78 IC1.4
  Top 0.406: v88.1,11.98 C7.1
  Bottom 0.305: 88.1,9.76 85.56,9.76 | 85.56,9.76 U$24.RST | 85.56,9.76 84.29,11.03 v74.13,11.03 | AUTORESET.1 AUTORESET.2 88.1,9.76 | SW1.1 96.93,8.49 96.35,8.49 95.09,9.76 88.1,9.76
  Bottom 0.406: AUTORESET.1 v88.1,11.98
!STEP-ENABLE  (via drill 0.3)
  Top 0.305: IC1.15 v55.41,26.91 | P1.!EN 16.98,27.54 29.05,27.54 29.68,28.18 29.68,29.45 30.95,30.71 36.03,30.71
  Top 1.016: R7.1 36.03,33.26 36.03,30.71 P2.!EN
  Bottom 0.305: P4.!EN 75.4,27.54 56.03,27.54 v55.41,26.92 v55.41,26.91 54.77,27.54 54.76,27.54 37.3,27.54 P2.!EN
!STEP-ENABLE-Z  (via drill 0.3)
  Top 0.305: IC1.32 v49.05,14.18 | v57.94,26.27 57.94,27.22 P3.!EN
  Top 1.016: R8.1 56.35,33.26 P3.!EN
  Bottom 0.305: v49.05,14.18 50.61,14.18 51.59,15.16 51.59,20.55 50.79,21.35 50.79,22.62 51.41,23.23 51.41,24.68 51.73,25 53.17,25 56.67,25 v57.94,26.27
#DTR
  Top 0.254: 87.68,9.76 C7.2
  Top 0.305: IC3.2 76.91,11.43 77.31,11.03 84.29,11.03 85.56,9.76 87.68,9.76
+IN
  Bottom 0.61: JP2.1 44.92,4.05 42.38,6.59 | 42.38,6.59 42.7,6.48 C20.1 42.38,6.59 | 42.38,6.59 41.74,7.22 37.94,7.22 36.35,8.81 IC4.1
A0  (via drill 0.3)
  Top 0.254: IC1.37 52.21,10.41 v54.13,8.49
  Bottom 0.203: 78.97,3.65 63.73,3.65
  Bottom 0.254: U$24.A0 78.97,3.65
  Bottom 0.305: v54.13,8.49 58.89,8.49 63.73,3.65
A1  (via drill 0.3)
  Top 0.305: IC1.36 v51.41,10.26
  Bottom 0.203: 76.91,3.17 63.49,3.17
  Bottom 0.254: U$24.A1 76.91,3.17
  Bottom 0.305: v51.41,10.26 53.81,7.86 58.81,7.86 63.49,3.17
A2
  Top 0.203: 69.05,5.32 69.05,4.05 69.45,3.65 73.89,3.65
  Top 0.254: 62.06,6.59 67.78,6.59 69.05,5.32 | 73.89,3.65 U$24.A2
  Top 0.305: 62.06,6.59 59.52,6.59 58.26,7.86 53.81,7.86 52.22,9.44 51.27,9.44 50.61,10.1 IC1.35
A3  (via drill 0.3)
  Top 0.203: v63.02,2.77 63.34,2.77 64.21,3.65 68.73,3.65 69.21,3.17 71.83,3.17
  Top 0.254: 71.83,3.17 U$24.A3
  Top 0.305: IC1.34 v49.81,10.39
  Bottom 0.305: v63.02,2.77 58.57,7.22 53.49,7.22 51.59,9.12 50.95,9.12 49.81,10.27 v49.81,10.39
A4  (via drill 0.3)
  Top 0.203: U$24.A4 69.61,2.14 68.57,3.17 64.68,3.17 v63.65,2.14
  Top 0.254: IC1.33 v46.83,13.38
  Bottom 0.305: v46.83,13.38 46.83,13.25 48.67,11.41 48.67,10.46 50.63,8.49 51.27,8.49 53.17,6.59 58.26,6.59 62.7,2.14 v63.65,2.14
AIFO  (via drill 0.3)
  Top 0.305: IC1.9 60.66,19.78 62.06,21.19 62.06,22.14 63.65,23.73 68.73,23.73 69.37,23.09 v69.37,18.33 | IC3.1 v76.25,18.33
  Bottom 0.305: v76.25,18.33 v69.37,18.33
AOFI  (via drill 0.3)
  Top 0.305: IC1.10 60.5,20.58 61.43,21.51 61.43,22.46 63.34,24.36 69.05,24.36 70,23.41 v70,18.97 | v76.99,18.97 78.26,18.97 78.86,18.37 IC3.5
  Bottom 0.305: v76.99,18.97 v70,18.97
AVCC  (via drill 0.3)
  Top 0.406: 44.76,18.18 44.6,18.33 | IC1.29 46.51,16.58 46.19,16.9 46.19,18.18
  Top 0.508: IC1.27 46.19,18.18 44.76,18.18
  Top 0.813: R10.2 v42.38,18.33 | R9.2 44.6,18.33 | 44.6,18.33 v42.38,18.33 | C14.1 44.6,18.33 | L1.2 v42.38,18.33
  Bottom 0.406: C19.1 37.94,14.84
  Bottom 0.61: IC4.7 38.25,10.08 37.94,10.39 37.94,14.84 37.94,16.11 40.16,18.33 v42.38,18.33
B-THERM  (via drill 0.3)
  Top 0.406: C9.1 v42.7,9.76 | IC1.31 46.65,14.98 46.19,14.52 43.33,14.52 v42.38,15.47 R10.1
  Bottom 0.406: 43.33,9.76 v42.7,9.76 43.33,9.76 | 43.33,9.76 43.33,14.52 v42.38,15.47 | JP24.1 50,3.73 43.97,9.76 43.33,9.76
E-DIR  (via drill 0.3)
  Top 0.305: IC1.40 v54.61,10.39
  Bottom 0.305: P4.DIR 93.18,27.54 76.67,27.54 76.03,26.91 59.52,26.91 55.4,22.78 55.4,21.19 54.61,20.4 v54.61,10.39
E-MOT-1A
  Bottom 1.524: P4.1A JP7.3
E-MOT-1B
  Bottom 1.524: P4.1B JP7.4
E-MOT-2A
  Bottom 1.524: P4.2A JP7.2
E-MOT-2B
  Bottom 1.524: P4.2B JP7.1
E-RESETSLEEP
  Bottom 1.016: P4.!RST P4.!SLP
E-STEP  (via drill 0.3)
  Top 0.305: P4.STEP v90,26.91 | IC1.41 v55.41,12.62
  Bottom 0.305: v90,26.91 77.31,26.91 76.67,26.27 59.84,26.27 56.03,22.46 56.03,20.86 55.25,20.08 55.25,12.78 v55.41,12.62
E-THERM  (via drill 0.3)
  Top 0.305: IC1.30 44.8,15.78 R9.1
  Top 0.406: C10.1 v45.87,9.76 | R9.1 v44.6,15.47 | v42.06,11.98 v44.6,11.98
  Bottom 0.406: v44.6,15.47 44.6,14.52 44.6,13.57 v44.6,11.98 44.6,11.35 44.6,11.03 v45.87,9.76 47.78,7.86 50.48,5.16 53.33,5.16 JP22.1 | IC4.6 42.06,11.35 v42.06,11.98 | v42.06,11.98 42.06,12.62 | 42.06,12.62 IC4.5 42.06,12.62 | 42.06,12.62 v42.06,11.98
GND  (via drill 0.3, 0.5, 0.6)
  Bottom 0.61: IC4.8 42.7,8.81 44.5,7 C20.2 44.92,6.59 47.46,4.05 JP2.2
  Bottom 1.778: 27.14,17.06 33.17,17.06
  other vias: 92.39,16.59 96.67,16.59 96.67,25.79 92.39,25.79 66.51,19.6 65.56,13.73 64.29,13.73 66.83,13.73 65.56,22.94 66.83,22.94 64.29,22.94 61.59,17.38 27.14,18.02 16.03,17.38 16.03,7.54 13.49,7.54 13.49,17.38 33.49,25.32 27.14,20.87 27.14,25.32 29.68,23.09 46.51,23.09 47.78,11.35 46.98,17.38 59.52,11.66 44.6,21.19 52.86,21.82 54.76,21.82 33.81,23.73 33.81,21.19 83.02,16.11 80.16,11.9 89.37,25 86.83,25 8.09,3.41 86.83,7.86 84.29,7.86 62.7,20.55 62.7,16.74 74.13,25.32 3.65,7.86 3.65,42.14 3.65,12.3 8.73,34.52 5.55,34.52 96.99,41.51 95.72,10.71 41.11,3.41 33.49,17.06 19.2,22.78 19.2,12.62 27.14,14.21 16.98,35.16 27.14,31.35 88.1,31.35 52.7,46.59 12.06,46.59 32.38,46.59 73.02,46.59 75.4,11.98 82.7,18.65 74.13,35.16 29.68,3.41 82.38,3.41 92.55,3.41 67.78,31.35 47.46,31.35 53.81,35.16 33.49,35.16 94.45,35.16 64.61,17.06 68.26,18.33 68.26,20.55 68.26,16.11 59.52,22.78 80.16,16.11 70.95,19.92 63.81,25 57.62,18.02 57.62,15.16 50.79,17.86 14.76,17.38 14.76,7.54 5.55,30.71 8.73,30.71
  pour Top (isolate 0.406, no thermals): 0,50 100,50 100,30.08 31.59,30.08 31.59,8.49 20.16,8.49 20.16,6.74 9.84,6.74 9.84,0 0,0
  pour Top (isolate 0.305): 32.86,27.54 100,27.54 100,0 10.63,0 10.63,5.95 22.7,5.95 22.54,7.7 32.7,7.7
  pour Bottom (isolate 0.305): 32.86,26.91 100,27.54 100,0 10.63,0 10.63,5.95 22.7,5.95 22.7,6.9 32.86,6.9
  pour Bottom (isolate 0.381, rank 2, no thermals): 14.76,30.08 100,30.08 100,50 0,50 0,0 9.84,0 9.84,6.74 20.16,6.74 21.27,7.86 31.59,7.86 31.59,27.54 14.76,27.54 14.44,27.86 14.44,29.76
HEATBED-GND  (via drill 0.6)
  Top 0.406: v13.49,24.05 15.39,24.05 | v13.49,20.87 15.39,20.87 | v17.3,20.87 15.39,20.87 | 15.39,20.87 v15.39,22.14 | v17.3,24.05 15.39,24.05 | 15.39,24.05 Q2.MB
  Top 2.54: 16.03,22.46 Q2.MB
  Bottom 3.048: HEATBED.1 16.03,22.46
  pour Bottom (isolate 0.254): 12.53,26.02 12.53,18.65 18.25,18.65 18.25,26.02
HOTEND-GND  (via drill 0.6)
  Top 0.406: v15.39,11.98 Q1.MB | v15.39,11.98 15.71,11.98 | 15.71,11.98 15.71,11.66 | 15.71,11.98 15.71,12.35 Q1.MB | v13.49,10.71 15.39,10.71 | v13.49,13.73 15.39,13.73 | v17.3,13.73 15.39,13.73 | 15.39,13.73 Q1.MB | v17.3,10.71 15.39,10.71 | 15.39,10.71 v15.39,11.98
  Bottom 3.048: HOTEND.1 14.44,12.3
  pour Bottom: 12.53,15.79 18.25,15.79 18.25,9.12 12.53,9.12
LED1
  Top 0.61: R1.1 LED1.A
N$1
  Top 0.305: C17.1 66.46,15.53 X1.1 66.46,17.45 65.73,18.18 65.58,18.33 63.65,18.33 63.5,18.18 IC1.7
N$2
  Top 0.305: IC3.19 82.1,22.34
  Top 0.508: 82.1,22.34 82.1,23.89
  Top 0.61: 82.1,23.89 82.1,25.91 81.75,26.27 80.48,26.27 R13.1
N$3
  Top 0.305: C18.1 64.66,21.14 X1.3 64.11,18.98 IC1.8
N$6
  Top 0.254: 85.56,19.6 arc90 85.88,19.92
  Top 0.305: IC3.16 84.06,20.16 arc90 84.61,19.6 85.56,19.6 | CN1.2 86.35,20.39 arc90 85.88,19.92
N$7
  Top 0.305: IC3.15 84.7,21.92 84.92,22.14 85.56,22.14 86.51,21.19 CN1.3
PB4-PWM
  Top 0.254: IC1.44 57.81,10.21 60.8,7.22 68.41,7.22 70.32,5.32 U$24.PWM
PB5-MOSI
  Top 0.203: IC1.1 59.72,13.38
  Top 0.305: U$24.MOSI 86.83,3.41 83.66,3.41 83.02,4.05 83.02,5.32 82.38,5.95 81.11,5.95 77.94,9.12 64.61,9.12 60.35,13.38 59.72,13.38
PB6-MISO  (via drill 0.3)
  Top 0.305: IC1.2 60.5,14.18 64.92,9.76 78.58,9.76 81.75,6.59 v86.83,6.59
  Bottom 0.305: v86.83,6.59 88.73,6.59 U$24.MISO
PB7-SCK  (via drill 0.3)
  Top 0.305: IC1.3 60.66,14.98 65.24,10.39 79.21,10.39 v81.75,7.86
  Bottom 0.305: U$24.SCK 86.83,3.41 83.66,3.41 83.02,4.05 83.02,6.59 v81.75,7.86
PC0-SCL  (via drill 0.3)
  Top 0.305: U$24.SCL 76.67,8.49 v62.06,8.49 | IC1.19 52.22,23.17 v52.22,24.36
  Bottom 0.305: v62.06,8.49 60.8,9.76 54.13,9.76 52.22,11.66 52.22,13.89 52.86,14.52 52.86,20.87 52.22,21.51 v52.22,24.36
PC1-SDA  (via drill 0.3)
  Top 0.305: U$24.SDA 74.77,7.86 v61.43,7.86 | IC1.20 v51.41,22.14
  Bottom 0.305: v61.43,7.86 60.16,9.12 53.81,9.12 51.59,11.35 51.59,14.21 52.22,14.84 52.22,20.71 51.41,21.53 v51.41,22.14
PD2-RX1  (via drill 0.3)
  Top 0.305: v72.22,11.98 72.22,23.41 70,25.64 63.34,25.64 60.8,23.09 60.8,21.82 60.35,21.38 IC1.11 | v71.59,5.79 72.07,6.27 73.81,6.27 U$24.RX1
  Bottom 0.305: v72.22,11.98 72.22,6.43 v71.59,5.79
PD3-TX1  (via drill 0.3)
  Top 0.305: IC1.12 57.81,23.92 58.57,24.68 | 58.57,24.68 61.43,24.68 | 61.43,24.68 63.02,26.27 70.32,26.27 72.86,23.73 v72.86,12.62 | 58.57,24.68 61.43,24.68
  Bottom 0.305: v72.86,12.62 U$24.TX1
VBUS
  Top 0.61: CN1.1 89.04,19.59 88.1,18.65 JP6.2
X-DIR  (via drill 0.3)
  Top 0.305: IC1.24 48.03,20.55 v49.05,20.55 | v46.83,24.36 46.83,26.27 46.19,26.91 34.12,26.91 33.49,27.54 P1.DIR
  Bottom 0.305: v49.05,20.55 49.05,22.14 v46.83,24.36
X-MOT-1A
  Bottom 1.524: P1.1A JP1.3
X-MOT-1B
  Bottom 1.524: P1.1B JP1.4
X-MOT-2A
  Bottom 1.524: P1.2A JP1.2
X-MOT-2B
  Bottom 1.524: P1.2B JP1.1
X-RESETSLEEP
  Bottom 1.016: P1.!SLP P1.!RST
X-STEP
  Top 0.305: IC1.16 54.61,27.07 55.08,27.54 55.08,29.45 54.45,30.08 40.48,30.08 39.84,29.45 39.84,28.18 39.2,27.54 35.39,27.54 34.76,28.18 34.76,29.45 34.12,30.08 31.59,30.08 30.95,29.45 P1.STEP
X-STOP  (via drill 0.3)
  Top 0.305: IC1.21 v50.61,25 | JP27.1 16.98,4.68 17.62,5.32 35.39,5.32 36.03,5.95 v36.03,20.24
  Bottom 0.305: v36.03,20.24 36.03,20.55 41.11,25.64 49.98,25.64 v50.61,25
Y-DIR  (via drill 0.3)
  Top 0.305: IC1.26 v50.79,18.98 | v48.73,24.36 48.73,24.68 51.59,27.54 52.86,27.54 53.81,28.49 P2.DIR
  Bottom 0.305: v50.79,18.98 50.79,20.55 50.16,21.19 50.16,22.94 v48.73,24.36
Y-MOT-1A
  Bottom 1.524: P2.1A JP3.3
Y-MOT-1B
  Bottom 1.524: P2.1B JP3.4
Y-MOT-2A
  Bottom 1.524: P2.2A JP3.2
Y-MOT-2B
  Bottom 1.524: P2.2B JP3.1
Y-RESETSLEEP
  Bottom 1.016: P2.!SLP P2.!RST
Y-STEP  (via drill 0.3)
  Top 0.305: IC1.25 v50,19.78 | v47.78,24.36 47.78,24.68 51.27,28.18 P2.STEP
  Bottom 0.305: v50,19.78 50,20.55 49.52,21.03 49.52,22.62 v47.78,24.36
Y-STOP  (via drill 0.3)
  Top 0.305: IC1.22 v49.81,24.36 | JP28.1 27.14,4.05 27.77,4.68 36.03,4.68 36.66,5.32 v36.66,19.6
  Bottom 0.305: v36.66,19.6 36.66,20.24 41.43,25 49.17,25 v49.81,24.36
Z-DIR  (via drill 0.3)
  Top 0.305: P3.DIR 72.86,27.54 62.06,27.54 v60.16,25.64 | v56.21,10.39 IC1.42 v56.21,13.41
  Bottom 0.305: v60.16,25.64 56.67,22.14 56.67,20.55 55.89,19.78 55.87,19.76 55.87,15.95 55.87,13.75 v56.21,13.41
Z-MOT-1A
  Bottom 1.524: P3.1A JP8.3 JP5.3
Z-MOT-1B
  Bottom 1.524: P3.1B JP8.4 JP5.4
Z-MOT-2A
  Bottom 1.524: P3.2A JP8.2 JP5.2
Z-MOT-2B
  Bottom 1.524: P3.2B JP8.1 JP5.1
Z-RESETSLEEP
  Bottom 0.813: P3.!SLP P3.!RST
Z-STEP  (via drill 0.3)
  Top 0.305: P3.STEP 72.86,30.08 74.77,30.08 75.4,29.45 75.4,28.18 74.13,26.91 62.38,26.91 v61.11,25.64 | IC1.43 v57.01,12.62
  Bottom 0.305: v61.11,25.64 57.3,21.82 57.3,20.24 56.51,19.44 56.51,14.36 57.01,13.86 v57.01,12.62
Z-STOP  (via drill 0.3)
  Top 0.305: JP29.1 v37.3,18.97 | IC1.23 v46.98,21.38
  Bottom 0.254: 44.6,23.73 44.63,23.73
  Bottom 0.305: v37.3,18.97 37.3,19.92 41.11,23.73 44.6,23.73 | 46.83,21.38 v46.98,21.38 44.63,23.73
(copper drawn outside any net)
  shapes: Top circle x1

### Text on the board
Top: +
bPlace: 1
tStop: +
Reference: 3.5 | t=1.2
tDocu: X-AXIS | Y-AXIS | Z-AXIS | EXTRUDER | + | - | + | - | + | 1 | - | 1 | RESET | Momoinololu Rev 1.1 | www.etosetora.org | X-STOP | Y-STOP | Z-STOP | +12V | +5V | PWM | TX1 | TX1 | RX1 | SDA | SCL | RST | SCK | MISO | + | - | + | - | + | - | EXT | ISP | GND | GND | A4 | A3 | A2 | A1 | A0 | GND | MOSI | +5V
bDocu: 2B | 2A | 1A | 1B | 2B | 2A | 1A | 1B | 2B | 2A | 1A | 1B | 2B | 2A | 1A | 1B | X-AXIS | Y-AXIS | Z-AXIS | EXTRUDER | 12V | POWER | MS1 | MS2 | MS3 | MS1 | MS2 | MS3 | MS1 | MS2 | MS3 | MS1 | MS2 | MS3 | GND | + | HEATBED | - | + | HOTEND | - | Momoinololu | Rev 1.1 | +12V | +5V | PWM | TX1 | RX1 | SDA | SCL | RST | SCK | MISO | GND | + | SIG | GND | + | SIG | GND | + | SIG | + | - | + | - | + | - | EXT | ISP | Thermocouple | B-THERM | E-THERM | 2014.05.08 | X-STOP | Y-STOP | Z-STOP | GND | GND | A4 | A3 | A2 | A1 | A0 | GND | MOSI | +5V